# EAGLE design ASL1002 (EAGLE 6.3)
DATABASE: ./../../../../../Components/TinyCircuits_Part_Database.txt
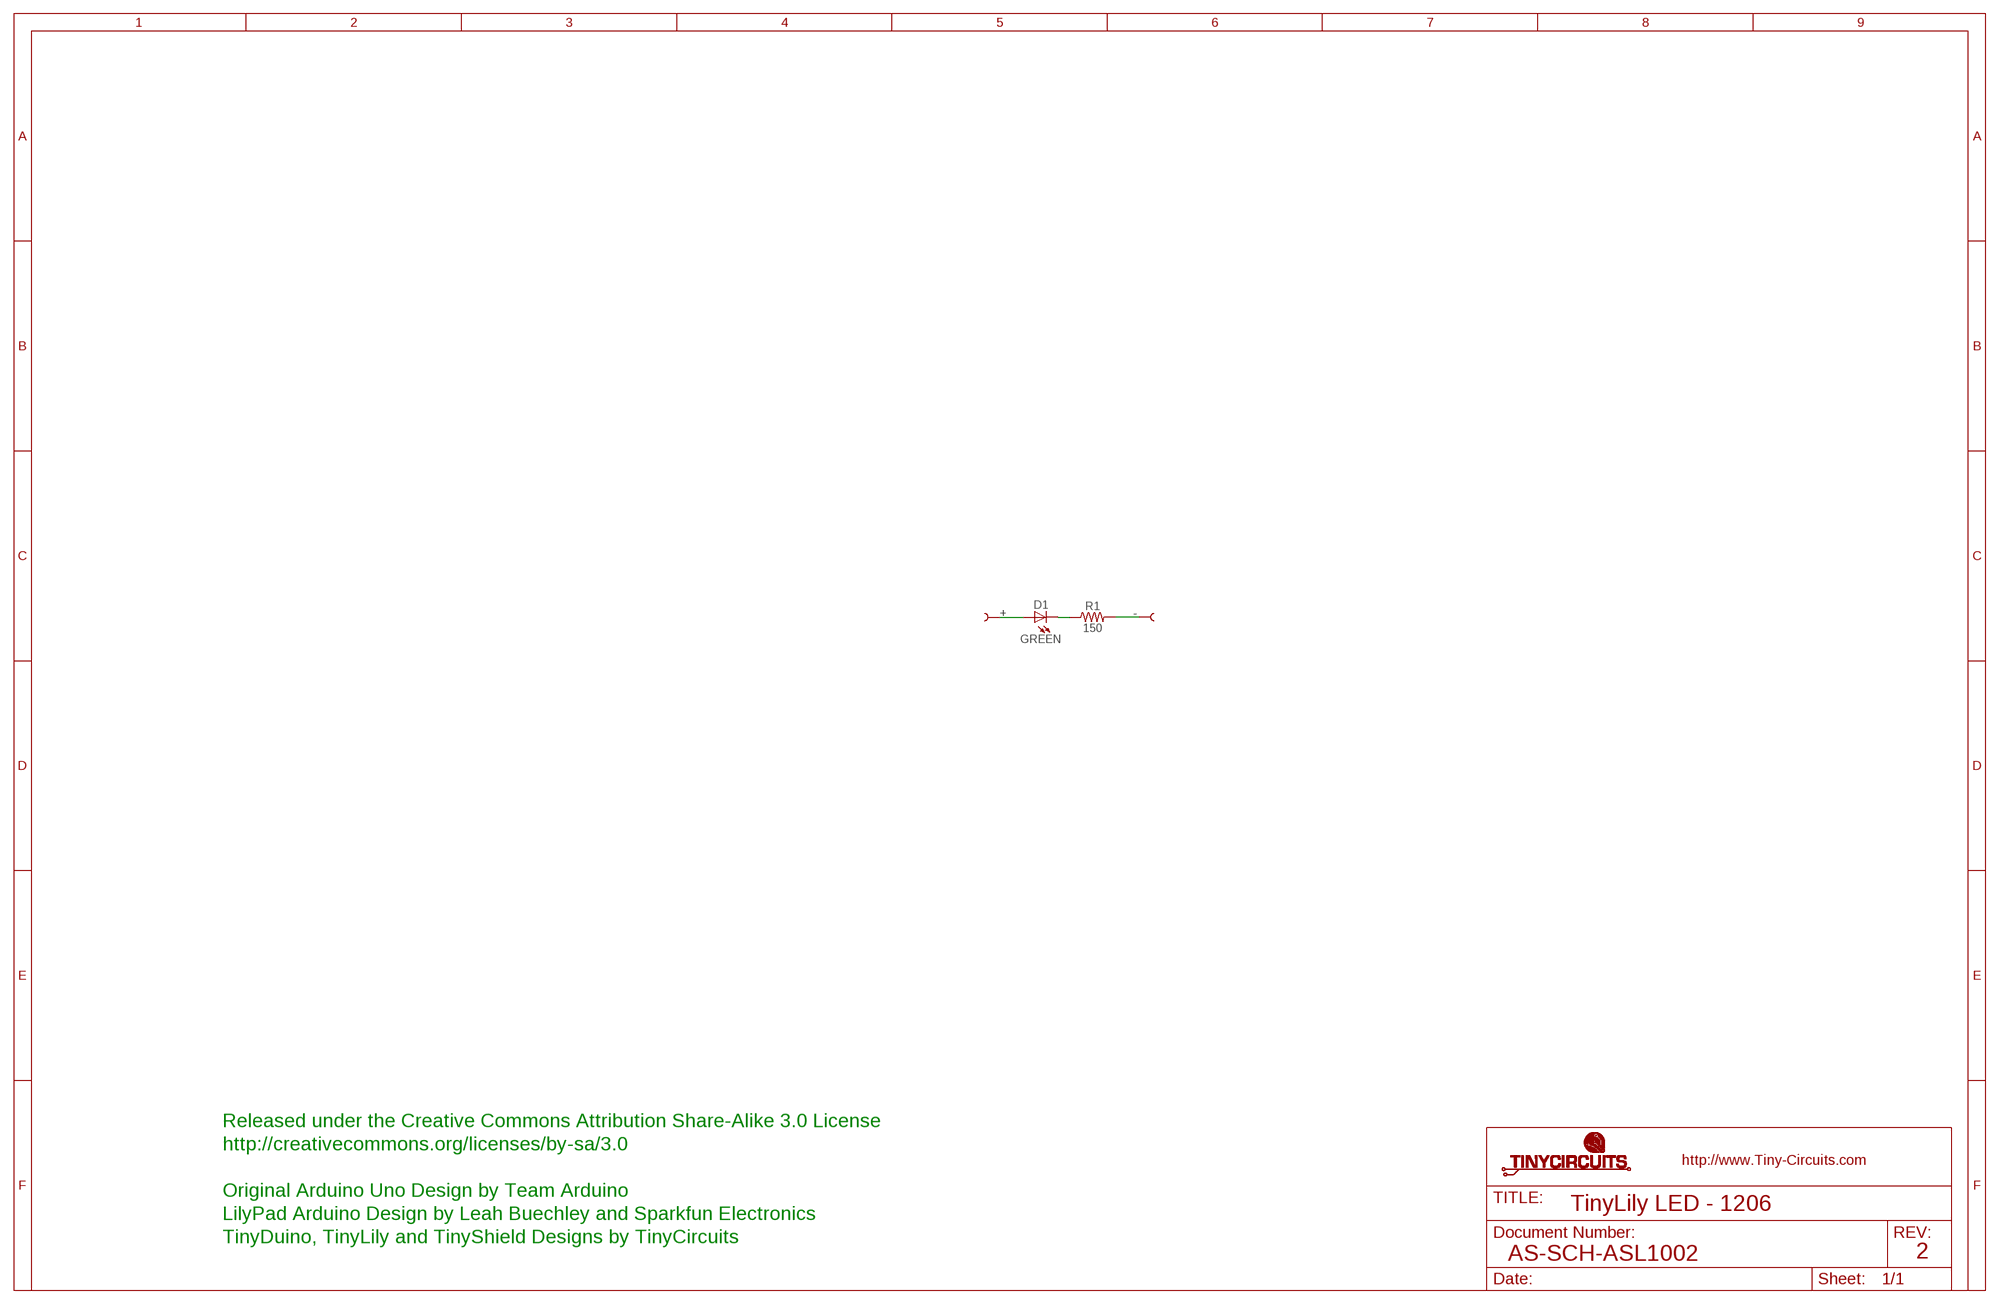
[diagram p0: schematic, sheet 1]

## Parts
D1  GREEN  AS-ITM-00039  [1206_LED]
R1  150  AS-ITM-00040  [R0805]
U$1  SEWTABTH_1206  [SEWTAP_TH_1206]
U$7  SEWTABTH_1206  [SEWTAP_TH_1206]

## Nets
+: D1.1(A) U$7.1
-: R1.2 U$1.1
N$2: D1.2(C) R1.1

## Notes on the sheet
- Released under the Creative Commons Attribution Share-Alike 3.0 License
- http://creativecommons.org/licenses/by-sa/3.0
- Original Arduino Uno Design by Team Arduino
- TinyLily LED - 1206
- LilyPad Arduino Design by Leah Buechley and Sparkfun Electronics
- TinyDuino, TinyLily and TinyShield Designs by TinyCircuits
- AS-SCH-ASL1002 | 2

## Library data of the parts
D1 = tinycircuits:AS-ITM-00039: LED 1206 GREEN CLR SMD; PARTNO: AS-ITM-00039
R1 = tinycircuits:AS-ITM-00040: RES 150 OHM 1/8W 1% 0805 SMD; PARTNO: AS-ITM-00040
U$1 U$7 = tinycircuits:SEWTAB: TinyLily Sew Tab; BOM: EXCLUDE; DNP: T

## Board
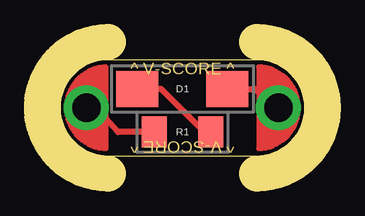
[diagram p1: board, top side]
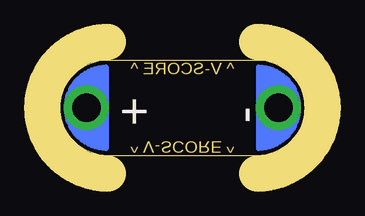
[diagram p2: board, bottom side, seen from below]

Size 10.2 x 4 mm. Coordinates in mm from the lower left corner, seen from the top.
Outline: 8.2,0 arc180 8.2,4 2,4
Outline: 2,4 arc180 2,0
Outline: 2,0 8.2,0
Outline: 2,4 arc180 2,0
Outline: 0,0 2,0
Outline: 8.2,0 10.2,0
Outline: 10.2,4 0,4
Copper layers (1*16): Top 0.035mm / dielectric 1.5mm / Bottom 0.035mm
Design rules "default": minimum track width 8mil, minimum drill 15mil, track to track 6mil, track to pad 6mil, pad to pad 6mil, via to via 6mil, smd to smd 6mil, copper to edge 6mil, drill to drill 8mil, minimum pad ring 8mil, minimum via ring 5mil, stop-mask expansion 4mil, vias tented up to drill 25mil, thermal gap 10mil
Milling: 2 lines

### Footprints (pad centres in the part's own frame; a part is rotated, then mirrored left to right if it is on the bottom)
1206_LED = smd 1.75 x 1.5: 1 -1.875,0; 2 1.875,0
R0805 = smd 1.05 x 1.3: 1 -1.175,0; 2 1.175,0
SEWTAP_TH_1206 = drill 1.2 pad 1.867: 1 0,0

### Placement (x,y rotation side)
D1  5.1,2.79 180 top
R1  5.1,0.99 180 top
U$1  1.1,2 180 bottom
U$6  [DOCFIELD-TINYCIRCUITS-PCB]  29.1,-18 0 top  (outside the outline)
U$7  9.1,2 0 bottom

### Tracks (layer width: path | path; a pad name or v marks a point on that pad's centre or on a via)
+
  Top 0.254: D1.1 8.12,2.79 U$7.1
-
  Top 0.254: R1.2 2.41,0.99 1.6,1.9 1.2,1.9 U$1.1
N$2
  Top 0.254: R1.1 6.23,1.19 5.8,1.2 4.21,2.79 D1.2

### Text on the board
Dimension: ^ V-SCORE ^ | ^ V-SCORE ^
bPlace: - | +
Document: FABRICATION DRAWING | NOTES: | 1. PRINTED CIRCUIT BOARD MADE FROM NEMA GRADE FR-4 EPOXY LAMINATE | WITH 1 OUNCE COPPER PLATING AND .024 THICKNESS. | 2. ALL DIMENSIONS ARE GIVEN IN INCHES. | 3. CIRCUIT PATHS ARE FOR REFERENCE ONLY. | 4. HOLE SIZES SHOWN ARE FINISHED DIAMETERS AFTER PLATING. | 5. BOARD PLATED USING REFLOW OR SIMILAR METHOD. | 6. BOARD TO HAVE BLUE SOLDER MASK ON PLATED SURFACES USING WET FILM | 7. SILKSCREEN BOARD USING WHITE INK. | SR100 OR SR1010 EPOXY. EQUIVALENT WET OR DRY FILM MAY BE USED. | 8. THE FOLLOWING INFORMATION APPLIES TO THIS BOARD: | * 2 COPPER LAYERS | * .024 BOARD THICKNESS | * REQUIRES TOP SIDE SILKSCREEN | Released under the Creative Commons Attribution Share-Alike 3.0 License | http://creativecommons.org/licenses/by-sa/3.0 | Original Arduino Uno Design by Team Arduino | LilyPad Arduino Design by Leah Buechley and Sparkfun Electronics | TinyDuino, TinyLily and TinyShield Designs by TinyCircuits | TinyLily LED - 1206 | AS-PCB-ASL1002 | 2